# EAGLE design NukeNanny (EAGLE 7.5.0)
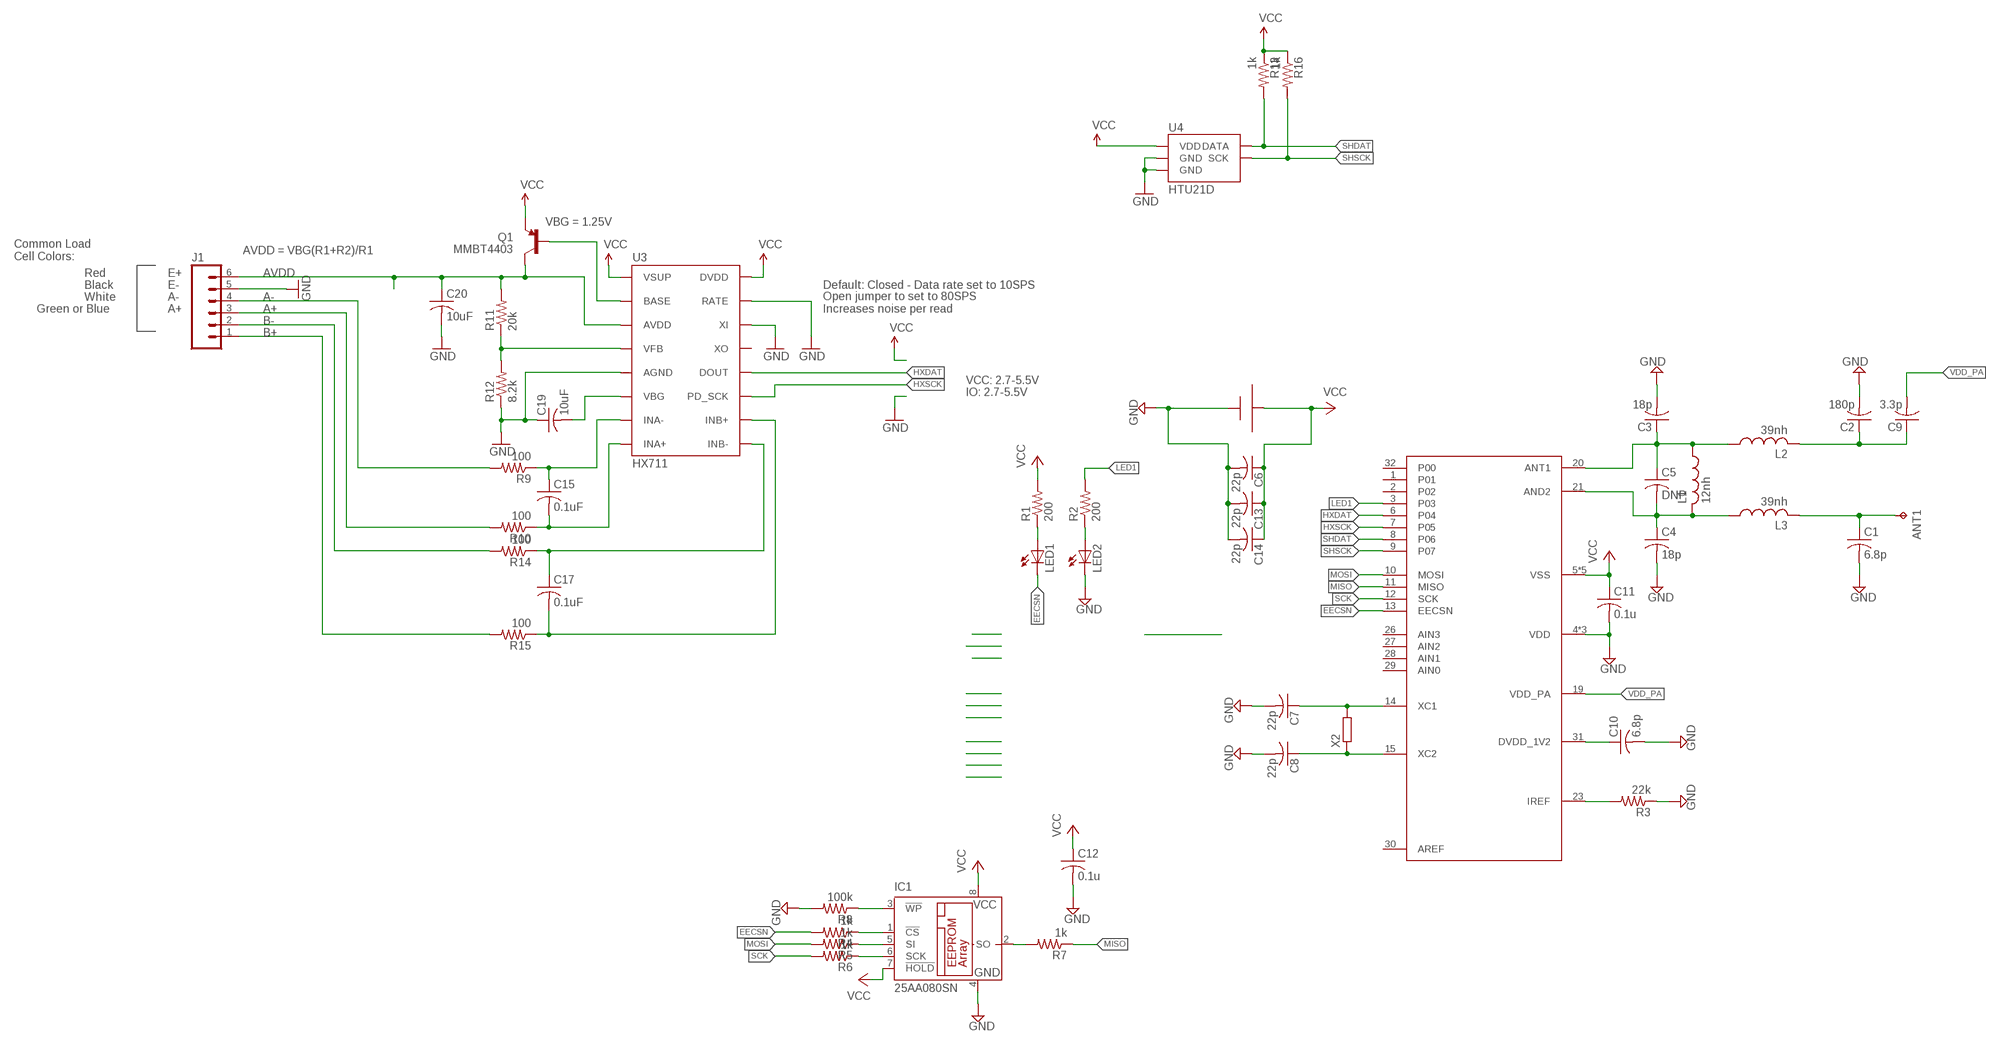
[diagram p0: schematic, sheet 1]

## Parts
ANT1  TPB2,54  [B2,54]
C1  6.8p  C-USC0805  [C0805]
C2  180p  C-USC0805  [C0805]
C3  18p  C-USC0805  [C0805]
C4  18p  C-USC0805  [C0805]
C5  DNP  C-USC0805  [C0805]
C6  22p  C-USC1206  [C1206]
C7  22p  C-USC0805  [C0805]
C8  22p  C-USC0805  [C0805]
C9  3.3p  C-USC0805  [C0805]
C10  6.8p  C-USC0805  [C0805]
C11  0.1u  C-USC0805  [C0805]
C12  0.1u  C-USC0805  [C0805]
C13  22p  C-USC1206  [C1206]
C14  22p  C-USC1206  [C1206]
C15  0.1uF  C-USC0805  [C0805]
C17  0.1uF  C-USC0805  [C0805]
C19  10uF  C-USC0805  [C0805]
C20  10uF  C-USC0805  [C0805]
IC1  25AA080SN  [SO-08]
J1  M06SMD-1MM  [1X06-1MM]
L1  12nh  L-USL2012C  [L2012C]
L2  39nh  L-USL2012C  [L2012C]
L3  39nh  L-USL2012C  [L2012C]
LED1  LEDCHIP-LED0805  [CHIP-LED0805]
LED2  LEDCHIP-LED0805  [CHIP-LED0805]
Q1  MMBT4403  TRANSISTOR_PNPMMBT4403  [SOT23-3]
R1  200  R-US_R0805  [R0805]
R2  200  R-US_R0805  [R0805]
R3  22k  R-US_R0805  [R0805]
R4  1k  R-US_R0805  [R0805]
R5  1k  R-US_R0805  [R0805]
R6  1k  R-US_R0805  [R0805]
R7  1k  R-US_R0805  [R0805]
R8  100k  R-US_R0805  [R0805]
R9  100  R-US_R0805  [R0805]
R10  100  R-US_R0805  [R0805]
R11  20k  R-US_R0805  [R0805]
R12  8.2k  R-US_R0805  [R0805]
R13  1k  R-US_R0805  [R0805]
R14  100  R-US_R0805  [R0805]
R15  100  R-US_R0805  [R0805]
R16  1k  R-US_R0805  [R0805]
U1  CR2032  [SMT_CR2032_HOLDER]
U3  HX711  HX711HX711  [SO16]
U4  HTU21D  HTU21DSMD  [HTU21D]
U$1  NRF9E5  [32QFN-THIN]
X2  R-EU_R3225  [R3225]

## Nets
A+: J1.3 R10.2
A-: J1.4 R9.2
AVDD: C20.1 J1.6 Q1.3(C) R11.2 U3.3(AVDD)
B+: J1.1 R15.2
B-: J1.2 R14.2
EECSN: LED1.C R4.2 U$1.13(EECSN)
GND: C1.2 C2.2 C3.2 C4.2 C6.2 C7.2 C8.2 C10.2 C11.2 C12.2 C13.2 C14.2 C19.1 C20.2 IC1.4(GND) J1.5 LED2.C R3.1 R8.2 R12.1 U1.- U3.5(AGND) U3.14(XI) U3.15(RATE) U4.7(GND) U4.GND U$1.4(VDD) U$1.17(VDD) U$1.25(VDD)
HXDAT: U3.12(DOUT) U$1.6(P04)
HXSCK: U3.11(PD_SCK) U$1.7(P05)
LED1: R2.2 U$1.3(P03)
MISO: R7.1 U$1.11(MISO)
MOSI: R5.2 U$1.10(MOSI)
N$12: C4.1 C5.2 L1.2 L3.1 U$1.21(AND2)
N$13: C3.1 C5.1 L1.1 L2.1 U$1.20(ANT1)
N$14: C10.1 U$1.31(DVDD_1V2)
N$15: C2.1 C9.1 L2.2
N$16: LED1.A R1.1
N$17: LED2.A R2.1
N$18: ANT1.TP C1.1 L3.2
N$19: C8.1 U$1.15(XC2) X2.1
N$20: C7.1 U$1.14(XC1) X2.2
N$21: IC1.1(!CS) R4.1
N$22: IC1.5(SI) R5.1
N$23: IC1.6(SCK) R6.1
N$24: IC1.2(SO) R7.2
N$25: R3.2 U$1.23(IREF)
N$26: IC1.3(!WP) R8.1
N$27: Q1.1(B) U3.2(BASE)
N$28: R11.1 R12.2 U3.4(VFB)
N$29: C19.2 U3.6(VBG)
N$30: C17.1 R14.1 U3.9(INB-)
N$31: C15.1 R9.1 U3.7(INA-)
N$32: C15.2 R10.1 U3.8(INA+)
N$33: C17.2 R15.1 U3.10(INB+)
SCK: R6.2 U$1.12(SCK)
SHDAT: R13.2 U4.DATA U$1.8(P06)
SHSCK: R16.2 U4.SCK U$1.9(P07)
VCC: C6.1 C11.1 C12.1 C13.1 C14.1 IC1.7(!HOLD) IC1.8(VCC) Q1.2(E) R1.2 R13.1 R16.1 U1.+ U3.1(VSUP) U3.16(DVDD) U4.VDD U$1.5(VSS) U$1.16(VSS) U$1.18(VSS) U$1.22(VSS) U$1.24(VSS)
VDD_PA: C9.2 U$1.19(VDD_PA)
Unconnected: U3.13(XO) U$1.1(P01) U$1.2(P02) U$1.26(AIN3) U$1.27(AIN2) U$1.28(AIN1) U$1.29(AIN0) U$1.30(AREF) U$1.32(P00)

## Notes on the sheet
- VBG = 1.25V
- AVDD = VBG(R1+R2)/R1
- Common Load
  Cell Colors:
- Red | E+
- Black | E- | Default: Closed - Data rate set to 10SPS
- White | A-
- Green or Blue | A+
- Open jumper to set to 80SPS
  Increases noise per read
- VCC: 2.7-5.5V
- IO: 2.7-5.5V

## Library data of the parts
ANT1 = testpad:TP: Test pad
C1-C15 C17 C19 C20 = rcl:C-US: CAPACITOR, American symbol
IC1 = microchip:25*: Serial EEPROM 4K/ 8K , SPI bus; MF: MICROCHIP; MPN: 25AA080/SN; OC_FARNELL: 1816072; OC_NEWARK: 92C7351
J1 = SparkFun-Connectors:M06: Header 6 Standard 6-pin 0.1" header. Use with straight break away headers (SKU : PRT-00116), right angle break away headers (PRT-00553), swiss pins (PRT-00743), machine pins (PRT-00117), and female headers (PRT-00115). Molex polarized connector foot print use with SKU : PRT-08094 with associated crimp pins and housings. NOTES ON THE VARIANTS LOCK and LOCK_LONGPADS... This footprint was designed to help hold the alignment of a through-hole component (i.e. 6-pin header) while soldering it into place. You may notice that each hole has been shifted either up or down by 0.005 of an inch from it's more standard position (which is a perfectly straight line). This slight alteration caused the pins (the squares in the middle) to touch the edges of the holes. Because they are alternating, it causes a "brace" to hold the component in place. 0.005 has proven to be the perfect amount of "off-center" position when using our standard breakaway headers. Although looks a little odd when you look at the bare footprint, once you have a header in there, the alteration is very hard to notice. Also,if you push a header all the way into place, it is covered up entirely on the bottom side. This idea of altering the position of holes to aid alignment will be further integrated into the Sparkfun Library for other footprints. It can help hold any component with 3 or more connection pins.
L1-L3 = rcl:L-US: INDUCTOR, American symbol
LED1 LED2 = led:LED: LED OSRAM: - CHIPLED LG R971, LG N971, LY N971, LG Q971, LY Q971, LO R971, LY R971 LH N974, LH R974 LS Q976, LO Q976, LY Q976 LO Q996 - Hyper CHIPLED LW Q18S LB Q993, LB Q99A, LB R99A - SideLED LS A670, LO A670, LY A670, LG A670, LP A670 LB A673, LV A673, LT A673, LW A673 LH A674 LY A675 LS A676, LA A676, LO A676, LY A676, LW A676 LS A679, LY A679, LG A679 - Hyper Micro SIDELED® LS Y876, LA Y876, LO Y876, LY Y876 LT Y87S - SmartLED LW L88C, LW L88S LB L89C, LB L89S, LG L890 LS L89K, LO L89K, LY L89K LS L896, LA L896, LO L896, LY L896 - TOPLED LS T670, LO T670, LY T670, LG T670, LP T670 LSG T670, LSP T670, LSY T670, LOP T670, LYG T670 LG T671, LOG T671, LSG T671 LB T673, LV T673, LT T673, LW T673 LH T674 LS T676, LA T676, LO T676, LY T676, LB T676, LH T676, LSB T676, LW T676 LB T67C, LV T67C, LT T67C, LS T67K, LO T67K, LY T67K, LW E67C LS E67B, LA E67B, LO E67B, LY E67B, LB E67C, LV E67C, LT E67C LW T67C LS T679, LY T679, LG T679 LS T770, LO T770, LY T770, LG T770, LP T770 LB T773, LV T773, LT T773, LW T773 LH T774 LS E675, LA E675, LY E675, LS T675 LS T776, LA T776, LO T776, LY T776, LB T776 LHGB T686 LT T68C, LB T68C - Hyper Mini TOPLED® LB M676 - Mini TOPLED Santana® LG M470 LS M47K, LO M47K, LY M47K Source: http://www.osram.convergy.de LUXEON: - LUMILED® LXK2-PW12-R00, LXK2-PW12-S00, LXK2-PW14-U00, LXK2-PW14-V00 LXK2-PM12-R00, LXK2-PM12-S00, LXK2-PM14-U00 LXK2-PE12-Q00, LXK2-PE12-R00, LXK2-PE12-S00, LXK2-PE14-T00, LXK2-PE14-U00 LXK2-PB12-K00, LXK2-PB12-L00, LXK2-PB12-M00, LXK2-PB14-N00, LXK2-PB14-P00, LXK2-PB14-Q00 LXK2-PR12-L00, LXK2-PR12-M00, LXK2-PR14-Q00, LXK2-PR14-R00 LXK2-PD12-Q00, LXK2-PD12-R00, LXK2-PD12-S00 LXK2-PH12-R00, LXK2-PH12-S00 LXK2-PL12-P00, LXK2-PL12-Q00, LXK2-PL12-R00 Source: www.luxeon.com KINGBRIGHT: KA-3528ASYC Source: www.kingbright.com
Q1 = SparkFun-DiscreteSemi:TRANSISTOR_PNP: Generic PNP BJT Double check pinouts against datasheets- not all devices are the same! MMBT3906 - 40V 200mA SOT-23 (TRANS-08052) MMBT4403 - 40V 600mA SOT-23 (TRANS-09245); PROD_ID: TRANS-09245
R1-R16 = rcl:R-US_: RESISTOR, American symbol
U1 = cr2032smt:CR2032
U3 = Testing:HX711; PROD_ID: IC-12445
U4 = SparkFun-Sensors:HTU21D
U$1 = nrf9e5:NRF9E5
X2 = resistor:R-EU_: RESISTOR, European symbol

## Board
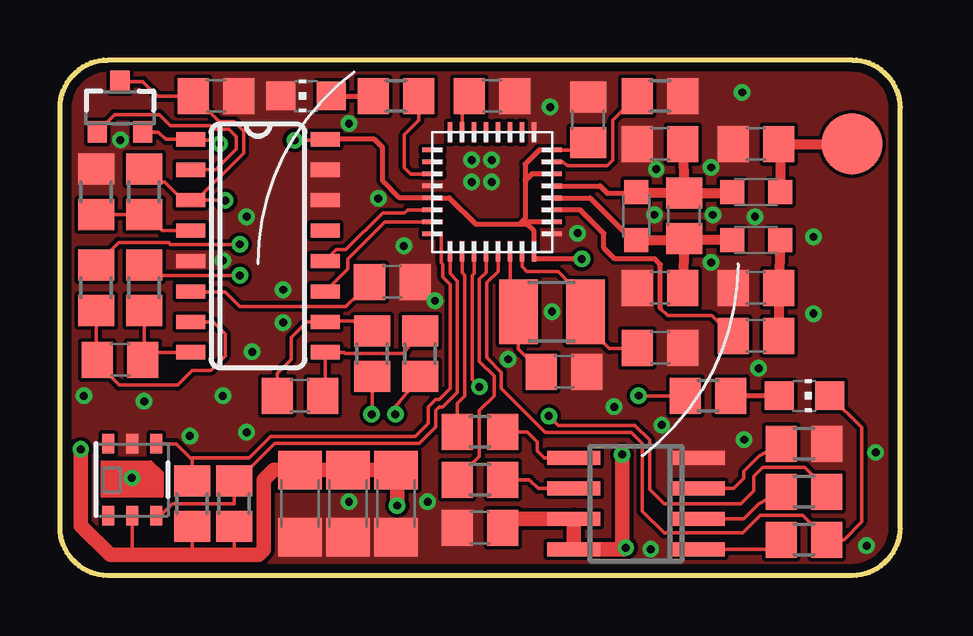
[diagram p1: board, top side]
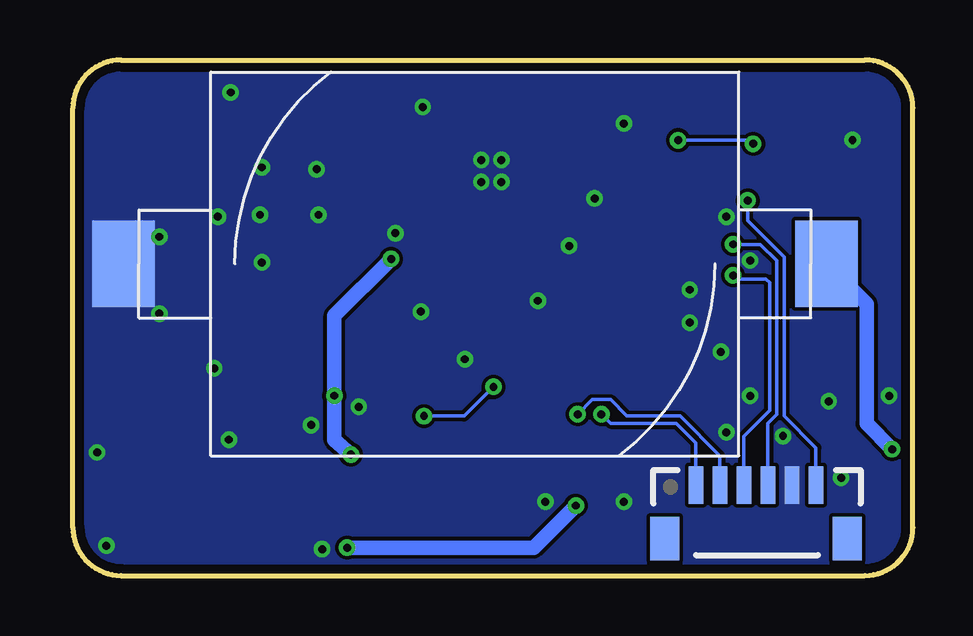
[diagram p2: board, bottom side, seen from below]

Size 35 x 21.5 mm. Coordinates in mm from the lower left corner, seen from the top.
Outline: 35,2 35,19.5 arc90 33,21.5 2,21.5 arc90 0,19.5 0,2 arc90 2,0 33,0 arc90 35,2
Copper layers (1*16): Top 0.0356mm / dielectric 1.5011mm / Bottom 0.0356mm
Design rules "LaenPCBOrder *": minimum track width 6mil, minimum drill 13mil, track to track 6mil, track to pad 6mil, pad to pad 6mil, via to via 6mil, smd to smd 6mil, copper to edge 15mil, drill to drill 6mil, minimum pad ring 7mil, minimum via ring 7mil, stop-mask expansion 3mil, vias tented up to drill 30mil, thermal gap 6mil

### Footprints (pad centres in the part's own frame; a part is rotated, then mirrored left to right if it is on the bottom)
B2,54 = smd 2.54 x 2.54: TP 0,0
C0805 = smd 1.3 x 1.5: 1 -0.95,0; 2 0.95,0
C1206 = smd 1.6 x 1.8: 1 -1.4,0; 2 1.4,0
SO-08 = smd 0.6 x 2.2: 1 -1.905,-2.6; 2 -0.635,-2.6; 3 0.635,-2.6; 4 1.905,-2.6; 5 1.905,2.6; 6 0.635,2.6; 7 -0.635,2.6; 8 -1.905,2.6
1X06-1MM = smd 0.6 x 1.55: 1 -2.54,1.27; 2 -1.54,1.27; 3 -0.54,1.27; 4 0.46,1.27; 5 1.46,1.27; 6 2.46,1.27 | smd 1.2 x 1.8: P$1 -3.84,-0.955; P$2 3.76,-0.955
L2012C = smd 1 x 1: 1 -1,0; 2 1,0
CHIP-LED0805 = smd 1.2 x 1.2: A 0,-1.05; C 0,1.05
SOT23-3 = smd 0.8 x 0.9: 1 -0.95,-1; 2 0.95,-1; 3 0,1.1
R0805 = smd 1.3 x 1.5: 1 -0.95,0; 2 0.95,0
SMT_CR2032_HOLDER = smd 2.6 x 3.6: + 14.65,0; - -14.65,0
SO16 = smd 0.6 x 1.2: 1 -4.445,-2.8; 2 -3.175,-2.8; 3 -1.905,-2.8; 4 -0.635,-2.8; 5 0.635,-2.8; 6 1.905,-2.8; 7 3.175,-2.8; 8 4.445,-2.8; 9 4.445,2.8; 10 3.175,2.8; 11 1.905,2.8; 12 0.635,2.8; 13 -0.635,2.8; 14 -1.905,2.8; 15 -3.175,2.8; 16 -4.445,2.8
HTU21D = smd 0.2 x 0.2: 7 0,0 | smd 0.8 x 0.5: DATA 1.5,-1; GND 1.5,0; NC@1 -1.5,1; NC@6 1.5,1; SCK -1.5,-1; VDD -1.5,0
32QFN-THIN = smd 0.85 x 0.2: 1 -2.475,1.75; 2 -2.475,1.25; 3 -2.475,0.75; 4 -2.475,0.25; 5 -2.475,-0.25; 6 -2.475,-0.75; 7 -2.475,-1.25; 8 -2.475,-1.75; 17 2.475,-1.75; 18 2.475,-1.25; 19 2.475,-0.75; 20 2.475,-0.25; 21 2.475,0.25; 22 2.475,0.75; 23 2.475,1.25; 24 2.475,1.75 | smd 0.2 x 0.85: 9 -1.75,-2.475; 10 -1.25,-2.475; 11 -0.75,-2.475; 12 -0.25,-2.475; 13 0.25,-2.475; 14 0.75,-2.475; 15 1.25,-2.475; 16 1.75,-2.475; 25 1.75,2.475; 26 1.25,2.475; 27 0.75,2.475; 28 0.25,2.475; 29 -0.25,2.475; 30 -0.75,2.475; 31 -1.25,2.475; 32 -1.75,2.475
R3225 = smd 1.6 x 2.7: 1 -1.4,0; 2 1.4,0

### Placement (x,y rotation side)
ANT1  33,18 90 top
C1  29,18 180 top
C2  29,12 180 top
C3  25,12 180 top
C4  25,18 180 top
C5  26,15 90 top
C6  14,3 270 top
C7  21,8.5 0 top
C8  25,9.5 0 top
C9  29,10 180 top
C10  18,20 0 top
C11  22,19 90 top
C12  17.5,2 180 top
C13  10,3 270 top
C14  12,3 270 top
C15  2.5,9 0 top
C17  10,7.5 180 top
C19  13.85,12.25 180 top
C20  6.5,20 0 top
IC1  24,3 90 top
J1  6.5,2.5 0 bottom
L1  24,15 90 top
L2  29,14 0 top
L3  29,16 0 top
LED1  31.02,7.5 270 top
LED2  10.25,20 90 top
Q1  2.5,19.5 0 top
R1  27,7.5 180 top
R2  14,20 0 top
R3  25,20 180 top
R4  31,1.5 0 top
R5  17.5,6 180 top
R6  17.5,4 180 top
R7  31,3.5 180 top
R8  31,5.5 0 top
R9  1.5,12 90 top
R10  3.5,12 90 top
R11  3.5,16 90 top
R12  1.5,16 270 top
R13  5.5,3 90 top
R14  15,9.25 270 top
R15  13,9.25 270 top
R16  7.25,3 90 top
U1  18.25,13 0 bottom
U3  8.25,13.75 270 top
U4  3,4 90 top
U$1  18,16 0 top
X2  20.5,11 180 top

### Tracks (layer width: path | path; a pad name or v marks a point on that pad's centre or on a via)
A+  (via drill 0.33)
  Top 0.152: v7.49,12.52 3.93,12.52 R10.2
  Bottom 0.152: J1.3 7.04,5.81 5.97,6.88 5.97,12.21 6.12,12.36 7.34,12.36 v7.49,12.52
A-  (via drill 0.33)
  Top 0.152: R9.2 2.44,13.89 4.52,13.89 4.6,13.81 v7.49,13.81
  Bottom 0.152: v7.49,13.81 6.35,13.81 5.67,13.13 5.67,6.72 6.05,6.34 J1.4
AVDD  (via drill 0.33)
  Top 0.152: Q1.3 3.45,20.6 4.06,19.98 5.53,19.98 C20.1 6.63,18.92 7.27,18.92 7.65,18.54 7.65,17.62 5.68,15.66 U3.3 | R11.2 4.05,16.4 4.37,16.4 5.12,15.66 U3.3 | v6.89,15.64 6.87,15.66 U3.3
  Bottom 0.152: J1.6 4.04,5.33 5.36,6.65 5.36,13.28 6.89,14.8 v6.89,15.64
B+  (via drill 0.33)
  Top 0.152: R15.2 13,6.74 v12.98,6.72
  Bottom 0.152: v12.98,6.72 12.6,6.34 9.86,6.34 9.04,5.53 J1.1
B-  (via drill 0.33)
  Top 0.152: R14.2 13.97,7.02 v13.97,6.72
  Bottom 0.152: v13.97,6.72 13.36,7.34 12.6,7.34 11.91,6.65 9.7,6.65 8.04,4.98 J1.2
EECSN
  Top 0.152: U$1.13 18.25,12.68 17.78,12.21 17.78,9.09 18.39,8.48 18.39,7.79 20.22,5.96 23.8,5.96 24.26,5.51 24.26,2.69 25.17,1.77 28.45,1.77 29.19,2.51 30.94,2.51 R4.2 32.67,1.5 33.4,2.23 33.4,6.17 LED1.C
GND  (via drill 0.33)
  other vias: 20.5,11 6.78,13.14 2.52,18.16 9.3,10.54 9.3,11.92 2.99,4.07 14.33,13.75 15.32,3.08 17.99,16.41 17.99,17.33 17.15,17.33 17.15,16.41 5.41,5.82 7.78,5.97 8,9.33 0.99,7.5 3.51,7.27 6.78,7.5 12.04,3.08 24.62,1.1 28.5,5.67 25.07,6.28 23.09,7.04 29.11,8.64 33.99,5.13 33.61,1.25 21.57,14.28 27.21,15.04 24.77,15.04 24.84,16.95 27.13,17.02 28.43,20.15 20.42,19.54 31.4,14.13 31.4,10.93 12.04,18.85 13.26,15.73 15.62,11.46 18.67,9.02 7.78,14.96 28.96,14.96 27.13,13.06
  pour Top (no thermals): -1.5,22 37,22 37,-1.5 -1,-2.5 -1,21
  pour Bottom (no thermals): -1.27,23.34 -1.27,-1.12 37.21,-1.12 37.21,23.34
HXDAT
  Top 0.152: U3.12 11.52,13.58 11.91,13.58 13.44,15.11 14.35,15.11 14.5,15.25 U$1.6
HXSCK
  Top 0.152: U3.11 11.99,12.79 11.99,13.2 13.54,14.75 U$1.7
LED1
  Top 0.152: U$1.3 14.61,16.75 14.35,17.01 14.35,18.38 14.95,18.98 R2.2
MISO  (via drill 0.33)
  Top 0.152: U$1.11 17.25,12.59 17.17,12.52 17.17,8.17 v17.48,7.87 | R7.1 31.5,3.95 31.5,4.06 31.04,4.52 29.29,4.52 28.91,4.13 28.91,3.53 28.37,2.99 25.17,2.99 24.56,3.6 24.56,5.66 23.95,6.27 20.75,6.27 v20.37,6.65
  Bottom 0.152: v17.48,7.87 18.7,6.65 v20.37,6.65
MOSI
  Top 0.152: U$1.10 16.75,12.63 16.87,12.52 16.87,7.49 16.56,7.18 16.56,6.01 R5.2
N$12
  Top 0.203: U$1.21 22.51,16.25 22.81,15.95 24,15.95 L1.2
  Top 0.406: C5.2 28,15.95 L3.1 | C5.2 24,15.95 L1.2 | C4.1 C5.2
N$13
  Top 0.203: U$1.20 22.09,15.75 23.84,14 L1.1
  Top 0.406: L2.1 26,14 | L1.1 26,14 | 26,14 C5.1 C3.1
N$14
  Top 0.152: U$1.31 16.75,19.7 C10.1
N$15
  Top 0.406: L2.2 C2.1 C9.1
N$16
  Top 0.203: LED1.A R1.1
N$17
  Top 0.203: LED2.A R2.1
N$18
  Top 0.406: L3.2 30,18 C1.1 ANT1.TP
N$19
  Top 0.152: U$1.15 19.25,12.88 19.46,12.67 20.75,12.67 21.29,12.14 21.29,11.61 X2.1 22.51,10.39 22.51,9.85 22.89,9.47 24.02,9.47 C8.1
N$20
  Top 0.152: U$1.14 18.75,11.35 X2.2 19.1,9.45 C7.1
N$21
  Top 0.152: IC1.1 30.05,1.09 R4.1
N$22
  Top 0.152: IC1.5 20.17,4.9 19.89,5.19 19.89,5.57 19.46,6 R5.1
N$23
  Top 0.152: IC1.6 19.92,3.63 19.55,4 R6.1
N$24
  Top 0.152: IC1.2 28.49,2.37 29.12,3 R7.2
N$25
  Top 0.152: U$1.23 20.97,17.25 21.13,17.09 22.81,17.09 23.04,17.32 23.04,18.99 23.11,19.07 23.12,19.07 R3.2
  Top 0.203: 24.03,19.98 R3.2
N$26
  Top 0.152: IC1.3 28.08,3.63 28.5,4.05 28.5,4.35 29.14,5 R8.1
N$27
  Top 0.152: Q1.1 2.27,19.22 4.14,19.22 4.6,18.77 6.28,18.77 6.43,18.61 7.04,18.61 7.34,18.31 7.34,17.77 6.49,16.93 U3.2
N$28
  Top 0.152: R12.2 R11.1 4.05,14.5 4.14,14.5 4.25,14.39 U3.4
N$29
  Top 0.152: C19.2 12.44,11.75 11.91,11.22 7.49,11.22 6.89,11.83 5.46,11.83 U3.6
N$30
  Top 0.152: R14.1 14.37,9.32 14.35,9.32 14.3,9.26 11.89,9.26 11.85,9.3 U3.9 11.05,7.6 C17.1
N$31
  Top 0.152: R9.1 1.5,9.12 arc45 C15.1 2.01,8.54 2.01,8.4 2.47,7.95 4.9,7.95 5.51,8.55 6.28,8.55 6.89,9.16 6.89,10.08 6.39,10.57 U3.7
N$32
  Top 0.152: R10.1 3.5,9.12 arc-45 C15.2 3.45,9.3 U3.8
N$33
  Top 0.152: R15.1 12.88,9.95 12.22,10.61 11.09,10.61 U3.10 10.28,10.57 9.63,9.93 9.63,9.01 9.05,8.43 C17.2
SCK
  Top 0.152: U$1.12 17.75,12.64 17.48,12.36 17.48,8.94 18.09,8.33 18.09,7.49 17.48,6.88 17.48,4.97 17.02,4.52 17.02,4.47 R6.2
SHDAT
  Top 0.152: U$1.8 15.88,14.25 15.88,13.05 15.95,12.97 15.95,12.44 16.26,12.14 16.26,7.79 15.8,7.34 15.65,7.34 15.34,7.03 15.34,6.34 14.81,5.81 8.79,5.81 7.88,4.9 5.51,4.9 | 5.51,4.9 5.44,4.9 4.83,5.5 U4.DATA | R13.2 5.51,3.96 5.51,4.9
SHSCK
  Top 0.152: U$1.9 16.26,12.59 16.56,12.29 16.56,7.64 15.95,7.03 15.8,7.03 15.65,6.88 15.65,6.19 14.96,5.51 8.94,5.51 7.88,4.44 7.72,4.44 7.25,3.97 | 7.25,3.97 R16.2 | 7.25,3.97 7.27,3.95 7.27,2.99 4.67,2.99 4.18,2.5 U4.SCK
VCC  (via drill 0.33)
  Top 0.152: U$1.24 21.7,17.75 C11.1 | Q1.2 4.1,18.5 4.41,18.2 U3.1 5.49,18.16 6.5,18.16 v6.66,18 | v9.78,18.16 11.05,18.16 U3.16 | 23.5,1.09 v23.57,1.16 | v24.11,7.5 R1.2 | R13.1 5.5,0.86 5.13,0.86 | R16.1 7.25,0.86 7.19,0.86 | U4.VDD 3,0.86 2.77,0.86
  Top 0.203: 19.15,14.65 17.32,14.65 16.22,15.75 U$1.5 14.16,15.75 13.44,16.47 13.44,17.85 13.09,18.2 U3.16 | 19.15,14.65 19.38,14.65 | 19.38,14.65 19.46,14.65 19.75,14.36 U$1.16 19.75,13.2 21.67,13.2 | U$1.24 19.97,17.75 19.38,17.16 19.38,16.48 | 19.38,16.48 19.38,14.88 19.15,14.65 | U$1.22 19.65,16.75 19.38,16.48 | U$1.18 19.48,14.75 19.38,14.65
  Top 0.61: v14.05,2.91 14.05,4.35 C6.1 C14.1 C13.1 8.9,4.4 8.48,3.98 8.48,1.07 8.28,0.86 7.19,0.86 5.13,0.86 2.77,0.86 2.08,0.86 0.87,2.08 v0.87,5.27 | 23.5,1.09 IC1.8 IC1.7 18.81,2.37 C12.1 | v21.74,13.2 21.67,13.2 | v23.42,5.05 23.42,1.32 v23.57,1.16
  Bottom 0.152: v9.78,18.16 6.81,18.16 v6.66,18
  Bottom 0.61: v14.05,2.91 15.8,1.16 v23.57,1.16 | v23.42,5.05 24.11,5.66 v24.11,7.5 24.11,10.84 v21.74,13.2 | U1.+ 1.93,11.33 1.93,6.34 v0.87,5.27
VDD_PA
  Top 0.152: C9.2 27.99,10 27.15,10.84 25.33,10.84 25.02,11.14
  Top 0.203: 25.02,11.14 25.02,12.97 24.79,13.2 23.11,13.2 22.66,13.66 22.66,14.27 21.68,15.25 U$1.19